# Altium schematic sheet 06-BatteryManagement.SchDoc: Battery Management
size A2; DocumentNumber: 6; SheetNumber: 6; SheetTotal: 15
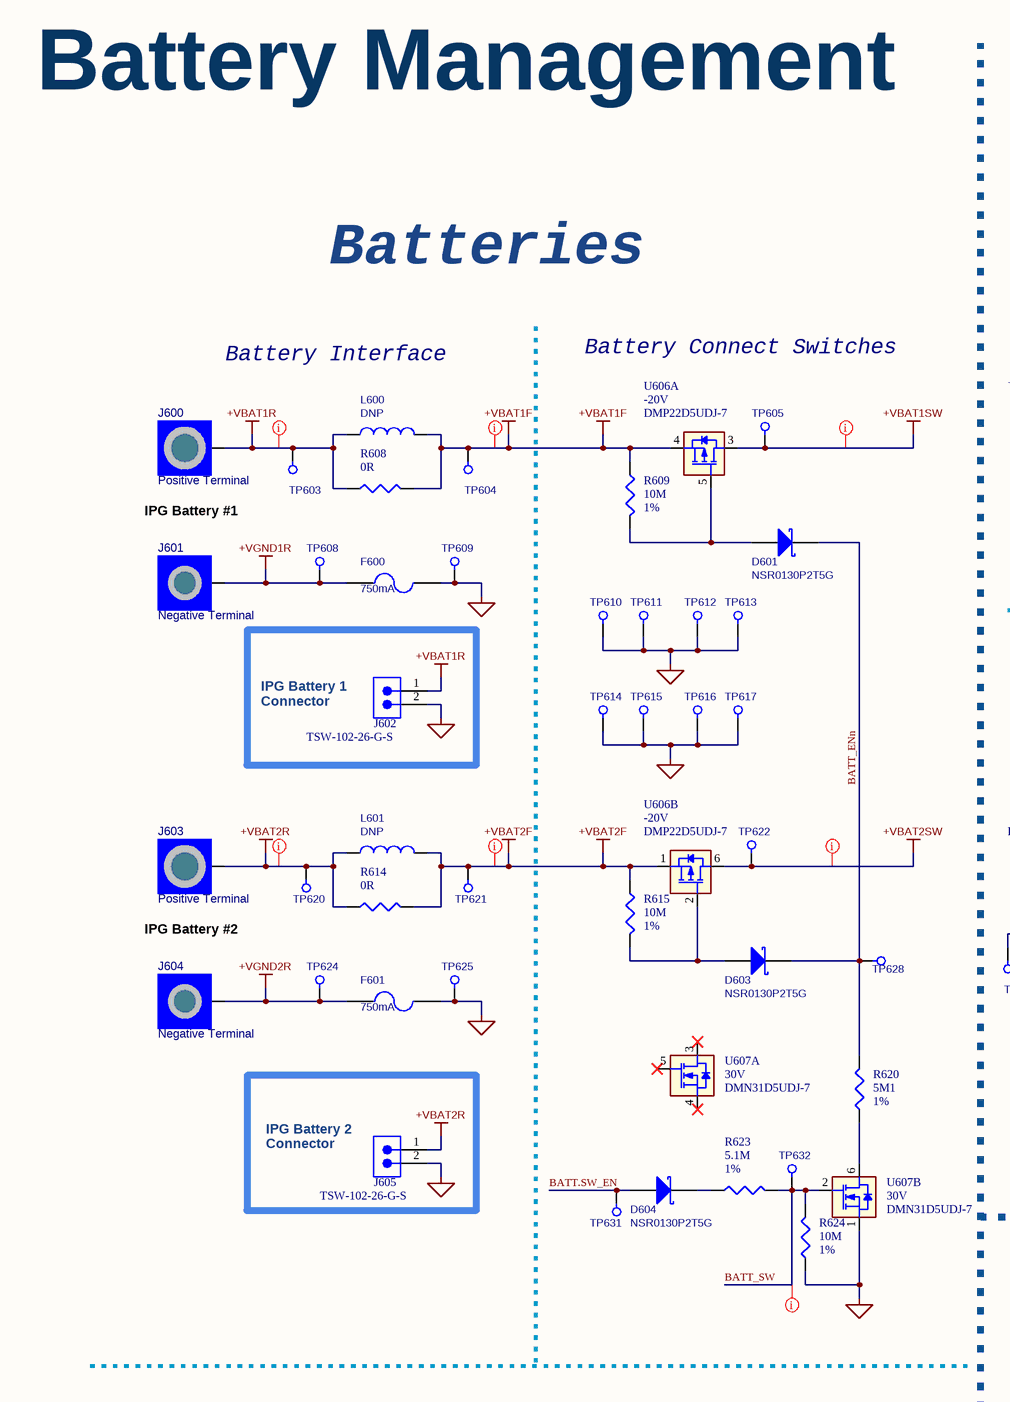
[diagram p0: 06-BatteryManagement.SchDoc, left]
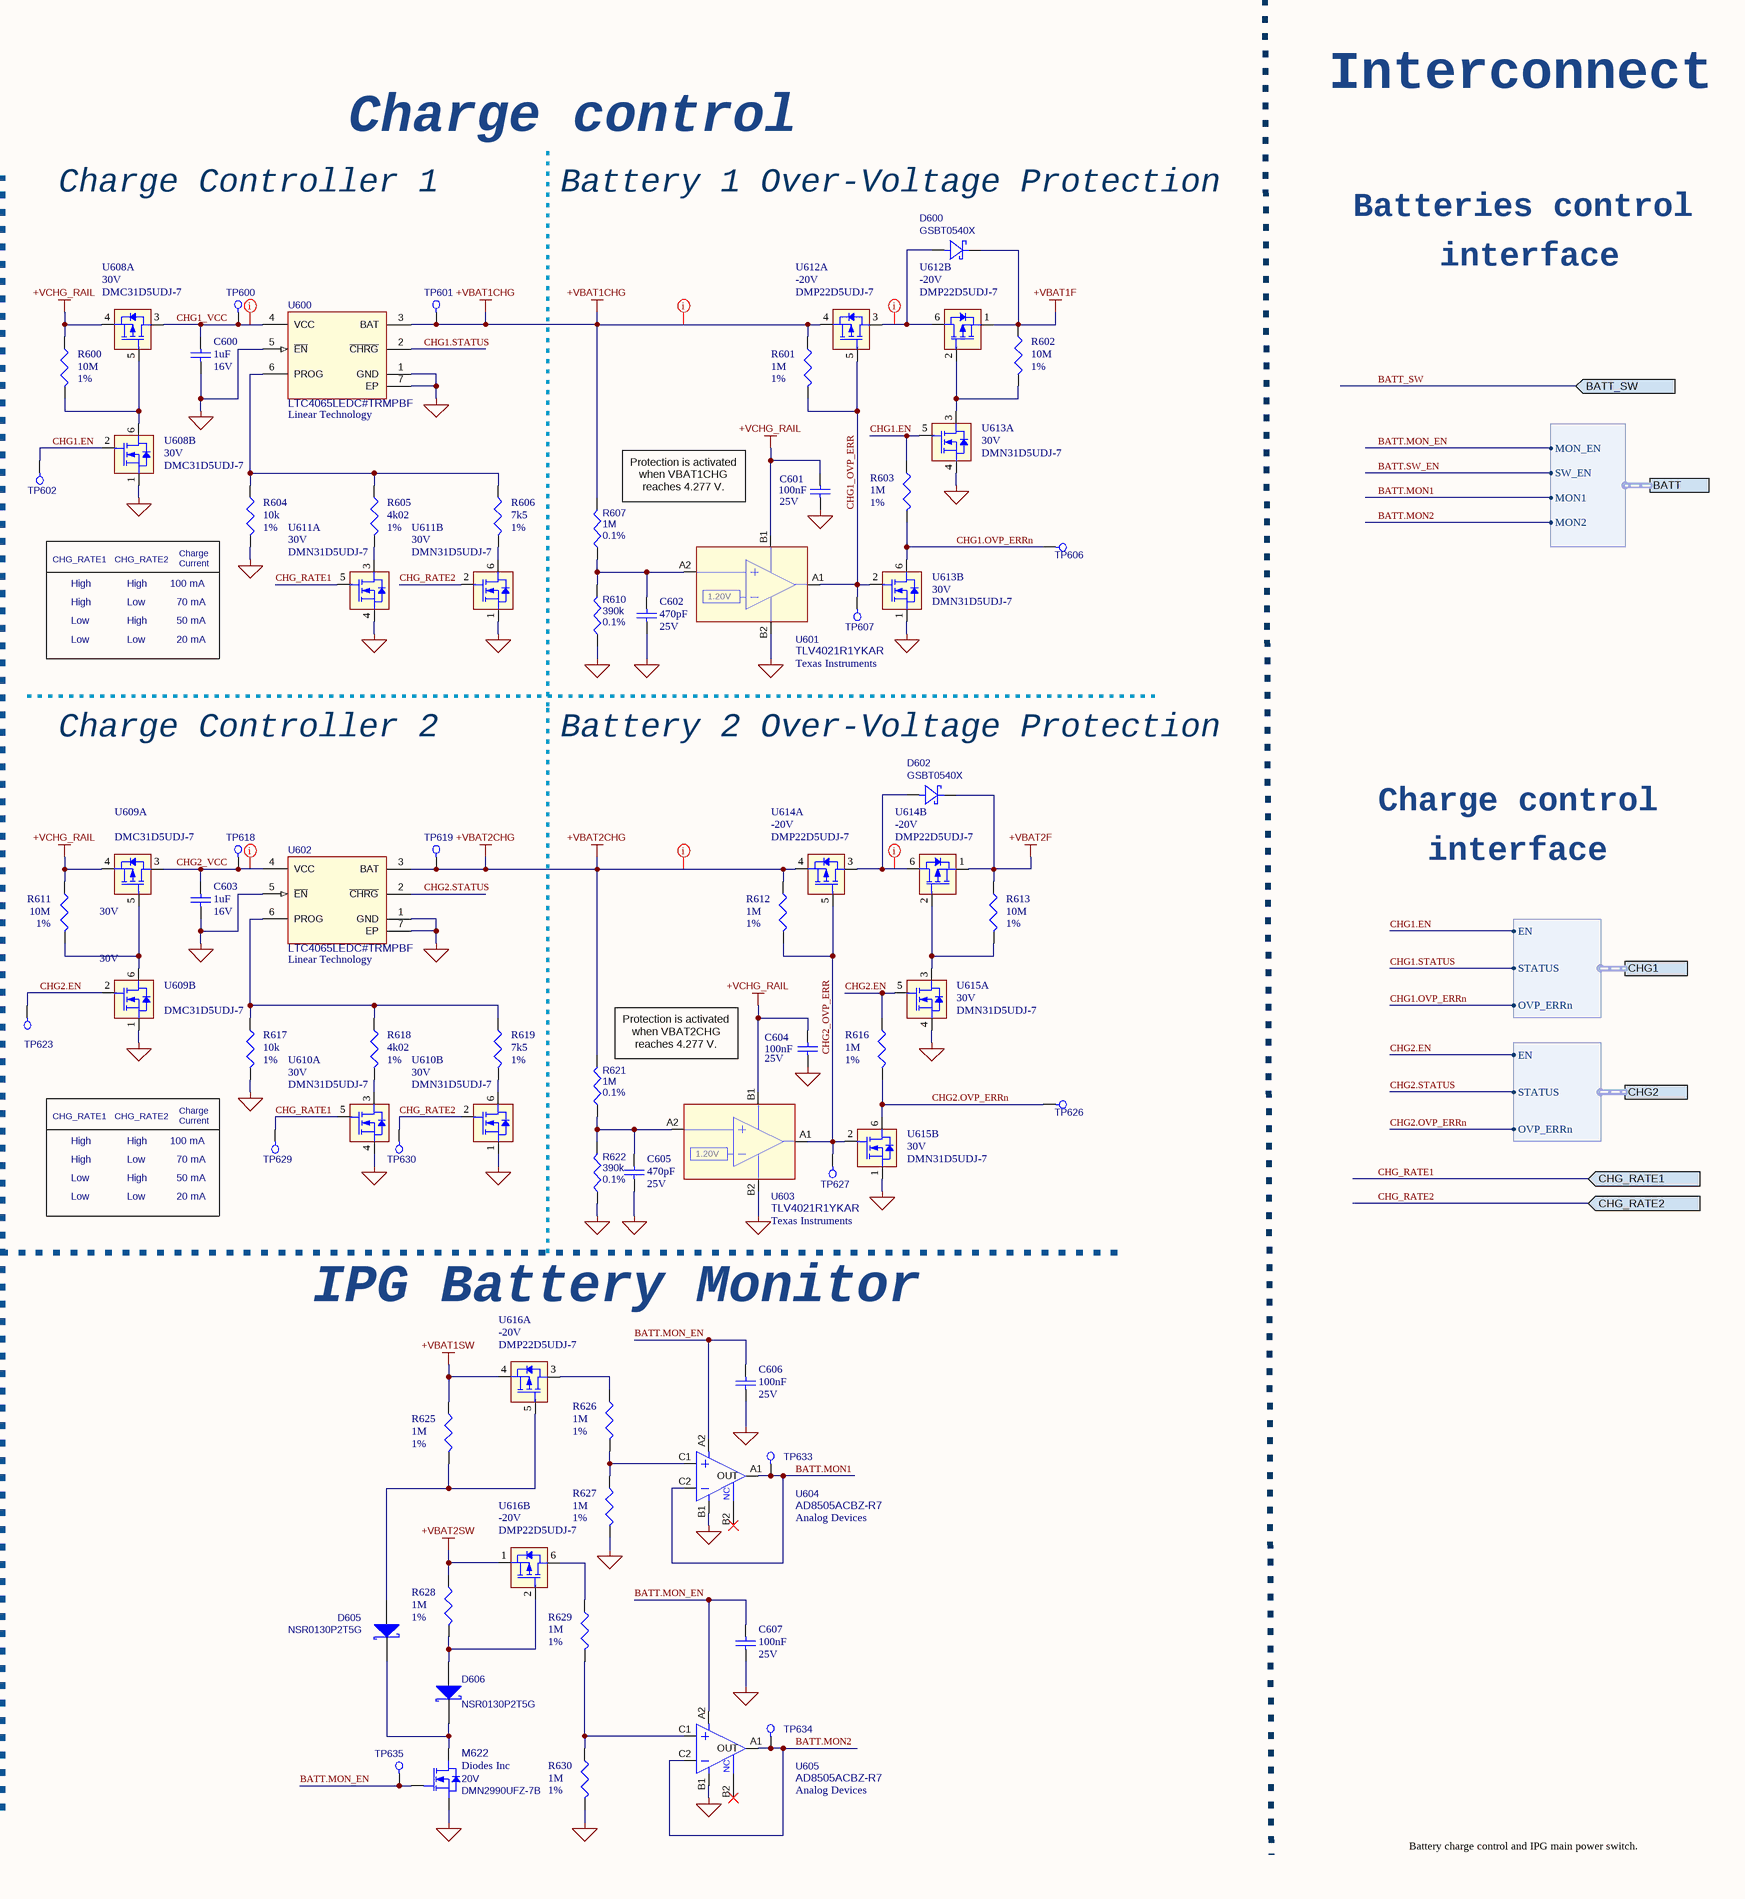
[diagram p1: 06-BatteryManagement.SchDoc, right]

## Parts
C600  value 1uF  Rated DC Voltage (URdc): 16V  [C0201_C]  (hidden comment: GRM033R61C105ME15D)
C601  value 100nF  Rated DC Voltage (URdc): 25V  [C0201_C]  (hidden comment: GRM033R61E104KE14J)
C602  value 470pF  Rated DC Voltage (URdc): 25V  [C0201_C]  (hidden comment: GCM033R71E471KA03D)
C603  value 1uF  Rated DC Voltage (URdc): 16V  [C0201_C]  (hidden comment: GRM033R61C105ME15D)
C604  value 100nF  Rated DC Voltage (URdc): 25V  [C0201_C]  (hidden comment: GRM033R61E104KE14J)
C605  value 470pF  Rated DC Voltage (URdc): 25V  [C0201_C]  (hidden comment: GCM033R71E471KA03D)
C606  value 100nF  Rated DC Voltage (URdc): 25V  [C0201_C]  (hidden comment: GRM033R61E104KE14J)
C607  value 100nF  Rated DC Voltage (URdc): 25V  [C0201_C]  (hidden comment: GRM033R61E104KE14J)
D600  GSBT0540X  [STM_SOD-523_R]
D601  NSR0130P2T5G  [ONSC_SOD-923_CASE514AB]
D602  GSBT0540X  [STM_SOD-523_R]
D603  NSR0130P2T5G  [ONSC_SOD-923_CASE514AB]
D604  NSR0130P2T5G  [ONSC_SOD-923_CASE514AB]
D605  NSR0130P2T5G  [ONSC_SOD-923_CASE514AB]
D606  NSR0130P2T5G  [ONSC_SOD-923_CASE514AB]
F600  value 750mA  [LITTELFUSE_440series_1206_REDUCED]  (hidden comment: 0440.750WR)
F601  value 750mA  [LITTELFUSE_440series_1206_REDUCED]  (hidden comment: 0440.750WR)
J600  value Positive Terminal  [Positive_Battery_PTH]  (hidden comment: Positive_Battery_PTH)  (no BOM)
J601  value Negative Terminal  [Negative_Battery_PTH]  (hidden comment: Negative_Battery_PTH)  (no BOM)
J602  TSW-102-26-G-S  [SMTC-TSW-102-26-XX-S]
J603  value Positive Terminal  [Positive_Battery_PTH]  (hidden comment: Positive_Battery_PTH)  (no BOM)
J604  value Negative Terminal  [Negative_Battery_PTH]  (hidden comment: Negative_Battery_PTH)  (no BOM)
J605  TSW-102-26-G-S  [SMTC-TSW-102-26-XX-S]
L600  DNP  [L0402_C]
L601  DNP  [L0402_C]
M622  DMN2990UFZ-7B  Manufacturer: Diodes Inc  Rating: 20V  [DIODESINC_X2-DFN0606-3]
R600  value 10M  Tolerance: 1%  [R0201_C]  (hidden comment: CRCW020110M0FNED)
R601  value 1M  Tolerance: 1%  [R0201_C]  (hidden comment: CRCW02011M00FNED)
R602  value 10M  Tolerance: 1%  [R0201_C]  (hidden comment: CRCW020110M0FNED)
R603  value 1M  Tolerance: 1%  [R0201_C]  (hidden comment: CRCW02011M00FNED)
R604  value 10k  Tolerance: 1%  [R0201_C]  (hidden comment: CRCW020110K0FNED)
R605  value 4k02  Tolerance: 1%  [R0201_C]  (hidden comment: CRCW02014K02FNED)
R606  value 7k5  Tolerance: 1%  [R0201_C]  (hidden comment: CRCW02017K50FNED)
R607  value 1M  Precision: 0.1%  [R0201_C]  (hidden comment: RE0201BRE071ML)
R608  value 0R  [R0201_C]  (hidden comment: CRCW02010000Z0ED)
R609  value 10M  Tolerance: 1%  [R0201_C]  (hidden comment: CRCW020110M0FNED)
R610  value 390k  Precision: 0.1%  [R0201_C]  (hidden comment: RGC1/20C3903BPA)
R611  value 10M  Tolerance: 1%  [R0201_C]  (hidden comment: CRCW020110M0FNED)
R612  value 1M  Tolerance: 1%  [R0201_C]  (hidden comment: CRCW02011M00FNED)
R613  value 10M  Tolerance: 1%  [R0201_C]  (hidden comment: CRCW020110M0FNED)
R614  value 0R  [R0201_C]  (hidden comment: CRCW02010000Z0ED)
R615  value 10M  Tolerance: 1%  [R0201_C]  (hidden comment: CRCW020110M0FNED)
R616  value 1M  Tolerance: 1%  [R0201_C]  (hidden comment: CRCW02011M00FNED)
R617  value 10k  Tolerance: 1%  [R0201_C]  (hidden comment: CRCW020110K0FNED)
R618  value 4k02  Tolerance: 1%  [R0201_C]  (hidden comment: CRCW02014K02FNED)
R619  value 7k5  Tolerance: 1%  [R0201_C]  (hidden comment: CRCW02017K50FNED)
R620  value 5M1  Tolerance: 1%  [R0201_C]  (hidden comment: CRCW02015M10FNED)
R621  value 1M  Precision: 0.1%  [R0201_C]  (hidden comment: RE0201BRE071ML)
R622  value 390k  Precision: 0.1%  [R0201_C]  (hidden comment: RGC1/20C3903BPA)
R623  value 5.1M  Tolerance: 1%  [R0201_C]  (hidden comment: CRCW02015M10FNED)
R624  value 10M  Tolerance: 1%  [R0201_C]  (hidden comment: CRCW020110M0FNED)
R625  value 1M  Tolerance: 1%  [R0201_C]  (hidden comment: CRCW02011M00FNED)
R626  value 1M  Tolerance: 1%  [R0201_C]  (hidden comment: CRCW02011M00FNED)
R627  value 1M  Tolerance: 1%  [R0201_C]  (hidden comment: CRCW02011M00FNED)
R628  value 1M  Tolerance: 1%  [R0201_C]  (hidden comment: CRCW02011M00FNED)
R629  value 1M  Tolerance: 1%  [R0201_C]  (hidden comment: CRCW02011M00FNED)
R630  value 1M  Tolerance: 1%  [R0201_C]  (hidden comment: CRCW02011M00FNED)
TP600  Test Point  [testpad_0.9mm]  (value not drawn)  (no BOM)
TP601  Test Point  [testpad_0.9mm]  (value not drawn)  (no BOM)
TP602  Test Point  [testpad_0.9mm]  (value not drawn)  (no BOM)
TP603  Test Point  [testpad_0.9mm]  (value not drawn)  (no BOM)
TP604  Test Point  [testpad_0.9mm]  (value not drawn)  (no BOM)
TP605  Test Point  [testpad_0.9mm]  (value not drawn)  (no BOM)
TP606  Test Point  [testpad_0.9mm]  (value not drawn)  (no BOM)
TP607  Test Point  [testpad_0.9mm]  (value not drawn)  (no BOM)
TP608  Test Point  [testpad_0.9mm]  (value not drawn)  (no BOM)
TP609  Test Point  [testpad_0.9mm]  (value not drawn)  (no BOM)
TP610  Test Point  [testpad_0.9mm]  (value not drawn)  (no BOM)
TP611  Test Point  [testpad_0.9mm]  (value not drawn)  (no BOM)
TP612  Test Point  [testpad_0.9mm]  (value not drawn)  (no BOM)
TP613  Test Point  [testpad_0.9mm]  (value not drawn)  (no BOM)
TP614  Test Point  [testpad_0.9mm]  (value not drawn)  (no BOM)
TP615  Test Point  [testpad_0.9mm]  (value not drawn)  (no BOM)
TP616  Test Point  [testpad_0.9mm]  (value not drawn)  (no BOM)
TP617  Test Point  [testpad_0.9mm]  (value not drawn)  (no BOM)
TP618  Test Point  [testpad_0.9mm]  (value not drawn)  (no BOM)
TP619  Test Point  [testpad_0.9mm]  (value not drawn)  (no BOM)
TP620  Test Point  [testpad_0.9mm]  (value not drawn)  (no BOM)
TP621  Test Point  [testpad_0.9mm]  (value not drawn)  (no BOM)
TP622  Test Point  [testpad_0.9mm]  (value not drawn)  (no BOM)
TP623  Test Point  [testpad_0.9mm]  (value not drawn)  (no BOM)
TP624  Test Point  [testpad_0.9mm]  (value not drawn)  (no BOM)
TP625  Test Point  [testpad_0.9mm]  (value not drawn)  (no BOM)
TP626  Test Point  [testpad_0.9mm]  (value not drawn)  (no BOM)
TP627  Test Point  [testpad_0.9mm]  (value not drawn)  (no BOM)
TP628  Test Point  [testpad_0.9mm]  (value not drawn)  (no BOM)
TP629  Test Point  [testpad_0.9mm]  (value not drawn)  (no BOM)
TP630  Test Point  [testpad_0.9mm]  (value not drawn)  (no BOM)
TP631  Test Point  [testpad_0.9mm]  (value not drawn)  (no BOM)
TP632  Test Point  [testpad_0.9mm]  (value not drawn)  (no BOM)
TP633  Test Point  [testpad_0.9mm]  (value not drawn)  (no BOM)
TP634  Test Point  [testpad_0.9mm]  (value not drawn)  (no BOM)
TP635  Test Point  [testpad_0.9mm]  (value not drawn)  (no BOM)
U600  value LTC4065LEDC#TRMPBF  Manufacturer: Linear Technology  [LT_DC6]  (hidden comment: LTC4065LEDC#TRPBF)
U601  Manufacturer: Texas Instruments  [TI_YKA0004]  (hidden comment: TLV4021R1YKAR)
U602  value LTC4065LEDC#TRMPBF  Manufacturer: Linear Technology  [LT_DC6]  (hidden comment: LTC4065LEDC#TRPBF)
U603  Manufacturer: Texas Instruments  [TI_YKA0004]  (hidden comment: TLV4021R1YKAR)
U604  Manufacturer: Analog Devices  [AD8505ACBZ-R7]  (hidden comment: AD8505ACBZ-R7)
U605  Manufacturer: Analog Devices  [AD8505ACBZ-R7]  (hidden comment: AD8505ACBZ-R7)
U606  DMP22D5UDJ-7  Vds(Max): -20V  [DIODESINC_SOT-963-6]  (parts A,B of 2)
U607  DMN31D5UDJ-7  Vds(Max): 30V  [DIODESINC_SOT-963-6]  (parts A,B of 2)
U608  DMC31D5UDJ-7  Vds(Max): 30V  [DIODESINC_SOT-963-6]  (parts A,B of 2)
U609  DMC31D5UDJ-7  Vds(Max): 30V  [DIODESINC_SOT-963-6]  (parts A,B of 2)
U610  DMN31D5UDJ-7  Vds(Max): 30V  [DIODESINC_SOT-963-6]  (parts A,B of 2)
U611  DMN31D5UDJ-7  Vds(Max): 30V  [DIODESINC_SOT-963-6]  (parts A,B of 2)
U612  DMP22D5UDJ-7  Vds(Max): -20V  [DIODESINC_SOT-963-6]  (parts A,B of 2)
U613  DMN31D5UDJ-7  Vds(Max): 30V  [DIODESINC_SOT-963-6]  (parts A,B of 2)
U614  DMP22D5UDJ-7  Vds(Max): -20V  [DIODESINC_SOT-963-6]  (parts A,B of 2)
U615  DMN31D5UDJ-7  Vds(Max): 30V  [DIODESINC_SOT-963-6]  (parts A,B of 2)
U616  DMP22D5UDJ-7  Vds(Max): -20V  [DIODESINC_SOT-963-6]  (parts A,B of 2)

## Ports
BATT (harness BATT), BATT_SW (in), CHG1 (harness CHG_CTRL), CHG2 (harness CHG_CTRL), CHG_RATE1 (in), CHG_RATE2 (in)

## Harnesses
CHG_CTRL: STATUS, OVP_ERRn, EN
BATT: MON_EN, SW_EN, MON1, MON2

## Nets
+VBAT1CHG: R601.1 R607.2 TP601.1 U600.3(BAT) U612.4
+VBAT1F: D600.1 L600.2 R602.1 R608.2 R609.1 TP604.1 U606.4 U612.1
+VBAT1R: J600.1 J602.1 L600.1 R608.1 TP603.1
+VBAT1SW: R625.1 TP605.1 U606.3 U616.4
+VBAT2CHG: R612.1 R621.2 TP619.1 U602.3(BAT) U614.4
+VBAT2F: D602.1 L601.2 R613.1 R614.2 R615.1 TP621.1 U606.1 U614.1
+VBAT2R: J603.1 J605.1 L601.1 R614.1 TP620.1
+VBAT2SW: R628.1 TP622.1 U606.6 U616.1
+VCHG_RAIL: C601.2 C604.2 R600.1 R611.1 U601.B1(V+) U603.B1(V+) U608.4 U609.4
+VGND1R: F600.1 J601.1 TP608.1
+VGND2R: F601.1 J604.1 TP624.1
GND: C600.2 C601.1 C602.1 C603.2 C604.1 C605.1 C606.1 C607.1 F600.2 F601.2 J602.2 J605.2 M622.2(S) R604.2 R610.1 R617.2 R622.1 R624.1 R627.2 R630.2 TP609.1 TP610.1 TP611.1 TP612.1 TP613.1 TP614.1 TP615.1 TP616.1 TP617.1 TP625.1 U600.1(GND) U600.5(~{EN}) U600.7(EP) U601.B2(V-) U602.1(GND) U602.5(~{EN}) U602.7(EP) U603.B2(V-) U604.B1(V-) U605.B1(V-) U607.1 U608.1 U609.1 U610.1 U610.4 U611.1 U611.4 U613.1 U613.4 U615.1 U615.4
BATT.MON1: TP633.1 U604.A1(OUT) U604.C2(IN-) ; port BATT.MON1
BATT.MON2: TP634.1 U605.A1(OUT) U605.C2(IN-) ; port BATT.MON2
BATT.MON_EN: C606.2 C607.2 M622.1(G) TP635.1 U604.A2(V+) U605.A2(V+) ; port BATT.MON_EN
BATT.SW_EN: D604.2(A) TP631.1 ; port BATT.SW_EN
BATT_ENn: D601.1(K) D603.1(K) R620.2 TP628.1
BATT_SW: R623.2 R624.2 TP632.1 U607.2 ; port BATT_SW
CHG1.EN: R603.1 TP602.1 U608.2 U613.5 ; port CHG1.EN
CHG1.OVP_ERRn: R603.2 TP606.1 U613.6 ; port CHG1.OVP_ERRn
CHG1.STATUS: U600.2(~{CHRG}) ; port CHG1.STATUS
CHG1_OVP_ERR: R601.2 TP607.1 U601.A1(OUT) U612.5 U613.2
CHG1_VCC: C600.1 TP600.1 U600.4(VCC) U608.3
CHG2.EN: R616.1 TP623.1 U609.2 U615.5 ; port CHG2.EN
CHG2.OVP_ERRn: R616.2 TP626.1 U615.6 ; port CHG2.OVP_ERRn
CHG2.STATUS: U602.2(~{CHRG}) ; port CHG2.STATUS
CHG2_OVP_ERR: R612.2 TP627.1 U603.A1(OUT) U614.5 U615.2
CHG2_VCC: C603.1 TP618.1 U602.4(VCC) U609.3
CHG_RATE1: TP629.1 U610.5 U611.5 ; port CHG_RATE1
CHG_RATE2: TP630.1 U610.2 U611.2 ; port CHG_RATE2
NetC602_2: C602.2 R607.1 R610.2 U601.A2(IN)
NetC605_2: C605.2 R621.1 R622.2 U603.A2(IN)
NetD600_2: D600.2 U612.3 U612.6
NetD601_2: D601.2(A) R609.2 U606.5
NetD602_2: D602.2 U614.3 U614.6
NetD603_2: D603.2(A) R615.2 U606.2
NetD604_1: D604.1(K) R623.1
NetD605_1: D605.1(K) D606.1(K) M622.3(D)
NetD605_2: D605.2(A) R625.2 U616.5
NetD606_2: D606.2(A) R628.2 U616.2
NetR600_2: R600.2 U608.5 U608.6
NetR602_2: R602.2 U612.2 U613.3
NetR604_1: R604.1 R605.1 R606.1 U600.6(PROG)
NetR605_2: R605.2 U611.3
NetR606_2: R606.2 U611.6
NetR611_2: R611.2 U609.5 U609.6
NetR613_2: R613.2 U614.2 U615.3
NetR617_1: R617.1 R618.1 R619.1 U602.6(PROG)
NetR618_2: R618.2 U610.3
NetR619_2: R619.2 U610.6
NetR620_1: R620.1 U607.6
NetR626_1: R626.1 U616.3
NetR626_2: R626.2 R627.1 U604.C1(IN+)
NetR629_1: R629.1 U616.6
NetR629_2: R629.2 R630.1 U605.C1(IN+)

Not connected (* = marked no-connect by the designer): U604 B2(NC)*; U605 B2(NC)*; U607 3* 4* 5*

## Layout directives
Voltage: 2.8-4.2V; net class POWER: +VBAT1CHG, +VBAT1F, +VBAT1R, +VBAT1SW, +VBAT2CHG, +VBAT2F, +VBAT2R, +VBAT2SW, NetD600_2, NetD602_2
rule Supply Nets [Voltage = 5.000]; net class POWER: CHG1_VCC, CHG2_VCC
net class ANALOG: BATT_SW

## Notes on the sheet
- Interconnect
- Charge control
- Battery Management
- Charge Controller 1
- Battery 1 Over-Voltage Protection
- Batteries control
- interface
- Batteries
- Battery Interface
- Battery Connect Switches
- (near R607) Protection is activated when VBAT1CHG reaches 4.277 V.
- CHG_RATE1
- CHG_RATE2
- IPG Battery #1
  Connections
- High
- Low
- (near R604) Charge
  Current
- 100 mA
- 70 mA
- 50 mA
- 20 mA
- Charge Controller 2
- Battery 2 Over-Voltage Protection
- (near J602) IPG Battery 1
  Connector
- IPG Battery #2
  Connections
- (near R621) Protection is activated when VBAT2CHG reaches 4.277 V.
- Charge
  Current
- (near J605) IPG Battery 2
  Connector
- IPG Battery Monitor
- Battery charge control and IPG main power switch.
- Project:
- Schematic:
- Design by:
- Date:
- Ver:
- .
- Comments:
- Reviewed by:
- (in symbol TLV4021R1YKAR) 1.20V

## Library data of the parts
C600 C603 = GRM033R61C105ME15D: Ceramic Capacitor, Multilayer, Ceramic, 16V, 20% +Tol, 20% -Tol, X5R, 15% TC, 1uF, Surface Mount, 0201; Manufacturer: Murata; Category: Ceramic Capacitors; Supplier: Digikey; Supplier Part Number: 490-18654-1-ND; Manufacturer Part Number: GRM033R61C105ME15D; RoHS: No; Stock: 132893; Pricing: 1=0,16, 10=0,105, 50=0,0628, 100=0,0493, 500=0,03644, 1000=0,03017, 2500=0,02808, 5000=0,02569 (USD); Supplier 1: Avnet; Supplier Part Number 1: GRM033R61C105ME15D
C601 C604 C606 C607 = GRM033R61E104KE14J: Ceramic Capacitor, Multilayer, Ceramic, 25V, 10% +Tol, 10% -Tol, X5R, 15% TC, 0.1uF, Surface Mount, 0201; Manufacturer: Murata; Multilayer: Yes; Category: Ceramic Capacitors; Supplier 1: Arrow Electronics; Supplier Part Number 1: GRM033R61E104KE14J; Manufacturer Part Number: GRM033R61E104KE14J; Supplier: Digikey; Supplier Part Number: 490-14571-1-ND; RoHS: Yes; Stock: 1540851; Pricing: 1=0,1, 10=0,033, 50=0,0192, 100=0,0148, 500=0,01118, 1000=0,00878, 2500=0,00798, 5000=0,00734 (USD); Mounting Technology: Surface Mount; Pins: 2; Dielectric Material: Ceramic; Package Shape: Rectangular; Case/Package: 0201; Terminal Finish: Nickel; Min Operating Temperature: -55°C; Max Operating Temperature: 85°C; JESD-609 Code: e3; Capacitor Type: Ceramic; Tolerance  (fill in as +-): 10%; Package Style: SMTMeter; Packaging: Tape and Reel; Tolerance (fill in as +-): 10%; Temperature Characteristics Code: X5R; Termination: Wraparound; Length: 0.6mm; Width: 0.3mm; Height: 0.3mm; Reach SVHC Compliant: Yes; RoHS Compliant: Yes; ComponentLink1URL: https://psearch.en.murata.com:443/capacitor/product/GRM033R61E104KE14%23.pdf?src-supplier=IHS+Markit; ComponentLink1Description: https://psearch.en.murata.com:443/capacitor/product/GRM033R61E104KE14%23.pdf?src-supplier=IHS+Markit; ComponentLink2URL: http://www.mouser.com/ds/2/281/c02e-2905.pdf?src-supplier=Mouser; ComponentLink2Description: http://www.mouser.com/ds/2/281/c02e-2905.pdf?src-supplier=Mouser; ComponentLink3URL: http://search.murata.co.jp/Ceramy/image/img/A01X/G101/ENG/GRM033R61E104KE14-01.pdf?src-supplier=Digikey; ComponentLink3Description: http://search.murata.co.jp/Ceramy/image/img/A01X/G101/ENG/GRM033R61E104KE14-01.pdf?src-supplier=Digikey; ComponentLink4URL: https://search.murata.co.jp/Ceramy/image/img/A01X/G101/ENG/GRM033R61E104KE14-01.pdf?src-supplier=Digikey; ComponentLink4Description: https://search.murata.co.jp/Ceramy/image/img/A01X/G101/ENG/GRM033R61E104KE14-01.pdf?src-supplier=Digikey
C602 C605 = GCM033R71E471KA03D: Ceramic Capacitor, Multilayer, Ceramic, 25V, 10% +Tol, 10% -Tol, X7R, 15% TC, 0.00047uF, Surface Mount, 0201; Manufacturer: Murata; Multilayer: Yes; Reference Standard: AEC-Q200; Category: Ceramic Capacitors; Supplier: Digikey; Supplier Part Number: 490-17744-1-ND; Manufacturer Part Number: GCM033R71E471KA03D; RoHS: Yes; Stock: 21174; Pricing: 1=0,1, 10=0,028, 50=0,016, 100=0,0125, 500=0,00938, 1000=0,00736, 2500=0,0067, 5000=0,00616 (USD); Mounting Technology: Surface Mount; Pins: 2; Dielectric Material: Ceramic; Package Shape: Rectangular; Case/Package: 0201; Terminal Finish: Nickel; Min Operating Temperature: -55°C; Max Operating Temperature: 125°C; JESD-609 Code: e3; Capacitor Type: Ceramic; Tolerance  (fill in as +-): 10%; Package Style: SMTMeter; Packaging: Tape and Reel; Tolerance (fill in as +-): 10%; Temperature Characteristics Code: X7R; Termination: Wraparound; Length: 0.6mm; Width: 0.3mm; Height: 0.33mm; Reach SVHC Compliant: Yes; RoHS Compliant: Yes; ComponentLink1URL: https://psearch.en.murata.com:443/capacitor/product/GCM033R71E471KA03%23.pdf?src-supplier=IHS+Markit; ComponentLink1Description: https://psearch.en.murata.com:443/capacitor/product/GCM033R71E471KA03%23.pdf?src-supplier=IHS+Markit; ComponentLink2URL: https://datasheet.ciiva.com/11604/product-11604532.pdf?src-supplier=Avnet; ComponentLink2Description: https://datasheet.ciiva.com/11604/product-11604532.pdf?src-supplier=Avnet; ComponentLink3URL: https://datasheet.ciiva.com/163/s0717e-163390.pdf?src-supplier=Digikey; ComponentLink3Description: https://datasheet.ciiva.com/163/s0717e-163390.pdf?src-supplier=Digikey; Supplier 1: Arrow Electronics; Supplier Part Number 1: GCM033R71E471KA03D
D600 D602 = GSBT0540X: DIODE SCHOTTKY 40V 500MA SOD523; Manufacturer: Good-Ark Semiconductor; Medical Grade MFR: TBD; Rating: 40V, 500mA; Medical Grade MFR PN: TBD; PCB Footprint: TBD; Category: Diode; Package Description: SOD-523; Supplier 1: Digikey; Supplier Part Number 1: 4786-GSBT0540XCT-ND; Manufacturer Part Number: GSBT0540X
D601 D603-D606 = NSR0130P2T5G: Schottky, 30V, 100mA, 385mV, 200mW, SOD-923; Manufacturer: ON Semiconductor; Medical Grade MFR: TBD; Review: 020823; Length (mm): 1.00 ±0.05; Medical Grade MFR PN: TBD; PCB Footprint: TBD; Rating: 30V; Thickness (mm): 0.40 ±0.03; Value: NSR0130P2T5G; Width (mm): 0.60 ±0.05; Category: Diode; Supplier 1: Future Electronics; Supplier Part Number 1: 7098145; Status: Approved; Manufacturer Part Number: NSR0130P2T5G
F600 F601 = 0440.750WR: Fuse, 750mA, 63V, 1206; Manufacturer: Littelfuse; Medical Grade MFR PN: 0440.750WRA; PCB Footprint: fuse1206_reduced; Review: 020823; Length (mm): 3.20 ±0.18; Medical Grade MFR: Littelfuse; Rating: 750mA; Thickness (mm): 0.84 ±0.01; Width (mm): 1.63 ±0.10; Category: Fuse; Supplier 1: Digi-Key; Supplier Part Number 1: F1603CT-ND; Status: Approved; Manufacturer Part Number: 0440.750WR
J600 J603 = Positive_Battery_PTH: Positive terminal battery PTH connector for the QL0200I-A battery; Manufacturer: Quallion; PCB Footprint: TBD; Manufacturer Part Number: QL0200I-A; Medical Grade MFR: N/A; Medical Grade MFR PN: N/A; Rating: N/A; Category: Connector; Length (mm): TBD; Thickness (mm): TBD; Width (mm): TBD; Status: *; Review: *; Type: Battery Connector
J601 J604 = Negative_Battery_PTH: Negative terminal battery PTH connector for the QL0200I-A battery; Manufacturer: Quallion; PCB Footprint: TBD; Manufacturer Part Number: QL0200I-A; Medical Grade MFR: N/A; Medical Grade MFR PN: N/A; Rating: N/A; Category: Connector; Length (mm): TBD; Thickness (mm): TBD; Width (mm): TBD; Status: *; Review: *; Type: Battery Connector
J602 J605 = TSW-102-26-G-S: Conn Unshrouded Header HDR 2 POS 2.54mm Solder ST Thru-Hole; Manufacturer: Samtec; Number of Contacts: 2; Gender: Male; Max Current Rating: 7.6A; Max Voltage Rating (AC): 550V; RoHS: True; ComponentLink1Description: Manufacturer URL; DatasheetVersion: F-214; Orientation: Vertical; Pitch: 2.54 mm; ComponentLink1URL: http://www.samtec.com; ComponentLink3Description: Package Specification; ComponentLink2Description: Datasheet; PackageVersion: DM, 8/1988; PackageDescription: .025[0.64] SQ. Post Terminal Strip Assembly; PackageReference: TSW-102-26-XX-S; Mounting Technology: Through-hole; Temperature Range: -55 to 125 degC; ComponentLink3URL: http://www.samtec.com/documents/webfiles/cpdf/TSW-XXX-XX-XXX-X-XX-XXX-MKT.pdf; ComponentLink2URL: http://www.samtec.com/documents/webfiles/pdf/TSW_TH.PDF; PartNumber: TSW-102-26-G-S; Supplier: Newark; Supplier Part Number: 12P1301; Manufacturer Part Number: TSW-102-26-G-S; Category: Connectors; Stock: 3117; Pricing: 1=0.51000, 10=0.47500, 100=0.33200, 500=0.28400, 1000=0.23700, 2500=0.21000, 5000=0.20400 (USD); Contact Material: Bronze; Contact Finish - Mating: GOLD; Insulation Color: Black; Insulation Material: PBT; Connector Type: Header; Termination: Solder; Flammability Rating: UL94 V-0; Reach SVHC Compliant: Yes; RoHS Compliant: Yes; ComponentLink4URL: https://datasheet.ciiva.com/10281/htsw-th-10281416.pdf?src-supplier=Avnet; ComponentLink4Description: https://datasheet.ciiva.com/10281/htsw-th-10281416.pdf?src-supplier=Avnet; ComponentLink5URL: https://datasheet.ciiva.com/6887/tsw-xxx-xx-xxx-x-xx-xxx-mkt-6887237.pdf?src-supplier=Digi-Key; ComponentLink5Description: https://datasheet.ciiva.com/6887/tsw-xxx-xx-xxx-x-xx-xxx-mkt-6887237.pdf?src-supplier=Digi-Key; Supplier 1: Digikey; Supplier Part Number 1: SAM1077-02-ND; Contact Plating: Gold; Color: Black; Housing Material: Polyester; Contact Shape: Square; Housing Color: Black; Min Operating Temperature: -55°C; Max Operating Temperature: 125°C; Number of Rows: 1; Packaging: Bulk; Number of Positions: 2; Series: TSW; Contact Type: Male Pin; Fastening Type: Pull; Package Quantity: 1; Length: 5.08mm; Width: 2.54mm; Contact Mating Length: 0.23inch; Depth: 2.54mm; Radiation Hardening: No; Lead Free: Lead Free
L600 L601 = IND_DNP_0402: DNP: Inductor, DNP, 0402; PCB Footprint: ind0402_reduced; Review: 020823; Value: DNP; Length (mm): 1.11; Manufacturer: N/A; Manufacturer PN: N/A; Medical Grade MFR: N/A; Medical Grade MFR PN: N/A; Rating: N/A; Thickness (mm): 0.65; Width (mm): 0.66; Category: Inductor; Package Description: 0402; Status: Approved
M622 = DMN2990UFZ-7B: MOSFET, N-Chan, 20V, 170mA, DFN0606; Medical Grade MFR: TBD; Review: 020823; Category: Transistor; Length (mm): 0.62 ±0.05; Medical Grade MFR PN: TBD; PCB Footprint: TBD; Thickness (mm): 0.38 ±0.02; Value: DMN2990UFZ-7B; Width (mm): 0.62 ±0.05; Supplier 1: Digi-Key; Supplier Part Number 1: DMN2990UFZ-7BDICT-ND; Status: Approved; Manufacturer Part Number: DMN2990UFZ-7B
R600 R602 R609 R611 R613 R615 R624 = CRCW020110M0FNED: Fixed Resistor, Metal Glaze/thick Film, 0.05W, 10000000ohm, 30V, 1% +/-Tol, 200ppm/Cel, Surface Mount, 0201; Manufacturer: Vishay Draloric; Medical Grade MFR: Mini-Systems; Medical Grade MFR PN: MWA96SM-1005F-NS62TR; Power: 50mW; Rated Temperature: 70°C; Temperature Coefficient: 200ppm/°C; Category: Chip SMD Resistors; Supplier: Mouser; Supplier Part Number: 71-CRCW020110M0FNED; Manufacturer Part Number: CRCW020110M0FNED; RoHS: Yes; Stock: 159754; Pricing: 1=0,1, 10=0,024, 50=0,024, 100=0,014, 1000=0,011, 10000=0,006 (USD); Mounting Technology: Surface Mount; Pins: 2; Package Shape: Rectangular; Case/Package: 0201; Terminal Finish: Nickel; Min Operating Temperature: -55°C; Max Operating Temperature: 155°C; JESD-609 Code: e3; Resistor Type: FIXED RESISTOR; Packaging: Tape and Reel; Technology: METAL GLAZE/THICK FILM; Termination: Wraparound; Working Voltage: 30V; Reach SVHC Compliant: Yes; RoHS Compliant: Yes; ComponentLink1URL: https://datasheet.ciiva.com:443/pdfs/VipMasterIC/IC/VISH/VISH-S-A0002932828/VISH-S-A0002932828-1.pdf?src-supplier=IHS+Markit; ComponentLink1Description: https://datasheet.ciiva.com:443/pdfs/VipMasterIC/IC/VISH/VISH-S-A0002932828/VISH-S-A0002932828-1.pdf?src-supplier=IHS+Markit; ComponentLink2URL: https://datasheet.ciiva.com/7673/1719906-7673177.pdf?src-supplier=Element14; ComponentLink2Description: https://datasheet.ciiva.com/7673/1719906-7673177.pdf?src-supplier=Element14; ComponentLink3URL: https://datasheet.ciiva.com/7673/1719906-7673178.pdf?src-supplier=Element14; ComponentLink3Description: https://datasheet.ciiva.com/7673/1719906-7673178.pdf?src-supplier=Element14; ComponentLink4URL: https://datasheet.ciiva.com/22692/1719906-22692711.pdf?src-supplier=Element14; ComponentLink4Description: https://datasheet.ciiva.com/22692/1719906-22692711.pdf?src-supplier=Element14; ComponentLink5URL: https://datasheet.ciiva.com/22665/1700795-22665701.pdf?src-supplier=Element14; ComponentLink5Description: https://datasheet.ciiva.com/22665/1700795-22665701.pdf?src-supplier=Element14; Supplier 1: Digikey; Supplier Part Number 1: 541-CRCW020110M0FNEDCT-ND
R601 R603 R612 R616 R625-R630 = CRCW02011M00FNED: Fixed Resistor, Metal Glaze/thick Film, 0.05W, 1000000ohm, 30V, 1% +/-Tol, 200ppm/Cel, Surface Mount, 0201; Manufacturer: Vishay; Medical Grade MFR: Mini-Systems; Medical Grade MFR PN: MWA96SM-1004F-NS62TR; Power: 50mW; Rated Temperature: 70°C; Temperature Coefficient: 200ppm/°C; Package Height: 0.23mm; Package Length: 0.6mm; Package Width: 0.3mm; Reference Standard: AEC-Q200; Category: Chip SMD Resistors; Supplier: Digikey; Supplier Part Number: 541-1.00MABCT-ND; Manufacturer Part Number: CRCW02011M00FNED; RoHS: Yes; Stock: 392914; Pricing: 1=0,1, 10=0,037, 50=0,0242, 100=0,0204, 500=0,01426, 1000=0,01241, 5000=0,00924 (USD); Mounting Technology: Surface Mount; Pins: 2; Package Shape: Rectangular; Case/Package: 0201; Terminal Finish: Nickel; Min Operating Temperature: -55°C; Max Operating Temperature: 155°C; JESD-609 Code: e3; Resistor Type: FIXED RESISTOR; Construction: Chip; Package Style: SMTMeter; Packaging: Tape and Reel; Technology: METAL GLAZE/THICK FILM; Termination: Wraparound; Working Voltage: 30V; Reach SVHC Compliant: Yes; RoHS Compliant: Yes; ComponentLink1URL: https://datasheet.ciiva.com:443/pdfs/VipMasterIC/IC/VISH/VISH-S-A0002932828/VISH-S-A0002932828-1.pdf?src-supplier=IHS+Markit; ComponentLink1Description: https://datasheet.ciiva.com:443/pdfs/VipMasterIC/IC/VISH/VISH-S-A0002932828/VISH-S-A0002932828-1.pdf?src-supplier=IHS+Markit; ComponentLink2URL: https://datasheet.ciiva.com/7841/1719906-7841438.pdf?src-supplier=Element14; ComponentLink2Description: https://datasheet.ciiva.com/7841/1719906-7841438.pdf?src-supplier=Element14; ComponentLink3URL: https://datasheet.ciiva.com/7841/1719906-7841439.pdf?src-supplier=Element14; ComponentLink3Description: https://datasheet.ciiva.com/7841/1719906-7841439.pdf?src-supplier=Element14; ComponentLink4URL: https://datasheet.ciiva.com/7859/dcrcwe3-7859689.pdf?src-supplier=Element14; ComponentLink4Description: https://datasheet.ciiva.com/7859/dcrcwe3-7859689.pdf?src-supplier=Element14; ComponentLink5URL: https://datasheet.ciiva.com/16757/70202042-16757675.pdf?src-supplier=Allied+Electronics; ComponentLink5Description: https://datasheet.ciiva.com/16757/70202042-16757675.pdf?src-supplier=Allied+Electronics; ComponentLink6URL: https://datasheet.ciiva.com/22692/1719906-22692761.pdf?src-supplier=Element14; ComponentLink6Description: https://datasheet.ciiva.com/22692/1719906-22692761.pdf?src-supplier=Element14; ComponentLink7URL: https://datasheet.ciiva.com/9109/crcw0201e3-9109910.pdf?src-supplier=Avnet; ComponentLink7Description: https://datasheet.ciiva.com/9109/crcw0201e3-9109910.pdf?src-supplier=Avnet; ComponentLink8URL: https://datasheet.ciiva.com/22675/1847332-22675065.pdf?src-supplier=Element14; ComponentLink8Description: https://datasheet.ciiva.com/22675/1847332-22675065.pdf?src-supplier=Element14; ComponentLink9URL: https://datasheet.ciiva.com/2474/crcw0201e3-2474824.pdf?src-supplier=Digikey; ComponentLink9Description: https://datasheet.ciiva.com/2474/crcw0201e3-2474824.pdf?src-supplier=Digikey; ComponentLink10URL: https://datasheet.ciiva.com/2474/crcw0201e3-2474825.pdf?src-supplier=Digikey; ComponentLink10Description: https://datasheet.ciiva.com/2474/crcw0201e3-2474825.pdf?src-supplier=Digikey; ComponentLink11URL: https://datasheet.ciiva.com/2474/crcw0201e3-2474826.pdf?src-supplier=Digikey; ComponentLink11Description: https://datasheet.ciiva.com/2474/crcw0201e3-2474826.pdf?src-supplier=Digikey; Supplier 1: Digikey; Supplier Part Number 1: 541-1.00MABCT-ND
R604 R617 = CRCW020110K0FNED: Fixed Resistor, Metal Glaze/thick Film, 0.05W, 10000ohm, 30V, 1% +/-Tol, 200ppm/Cel, Surface Mount, 0201; Manufacturer: Vishay; Medical Grade MFR: Mini-Systems; Medical Grade MFR PN: MWA96SM-1002F-NS62TR; Power: 50mW; Rated Temperature: 70°C; Temperature Coefficient: 200ppm/°C; Package Height: 0.23mm; Package Length: 0.6mm; Package Width: 0.3mm; Reference Standard: AEC-Q200; Category: Chip SMD Resistors; Supplier: Digikey; Supplier Part Number: 541-10.0KABCT-ND; Manufacturer Part Number: CRCW020110K0FNED; RoHS: Yes; Stock: 1011530; Pricing: 1=0,1, 10=0,037, 50=0,0242, 100=0,0204, 500=0,01426, 1000=0,01241, 5000=0,00924 (USD); Mounting Technology: Surface Mount; Pins: 2; Package Shape: Rectangular; Case/Package: 0201; Terminal Finish: Nickel; Min Operating Temperature: -55°C; Max Operating Temperature: 155°C; JESD-609 Code: e3; Resistor Type: FIXED RESISTOR; Construction: Chip; Package Style: SMTMeter; Packaging: Tape and Reel; Technology: METAL GLAZE/THICK FILM; Termination: Wraparound; Working Voltage: 30V; Reach SVHC Compliant: Yes; RoHS Compliant: Yes; ComponentLink1URL: https://datasheet.ciiva.com:443/pdfs/VipMasterIC/IC/VISH/VISH-S-A0002932828/VISH-S-A0002932828-1.pdf?src-supplier=IHS+Markit; ComponentLink1Description: https://datasheet.ciiva.com:443/pdfs/VipMasterIC/IC/VISH/VISH-S-A0002932828/VISH-S-A0002932828-1.pdf?src-supplier=IHS+Markit; ComponentLink2URL: https://datasheet.ciiva.com/2474/crcw0201e3-2474819.pdf?src-supplier=Digikey; ComponentLink2Description: https://datasheet.ciiva.com/2474/crcw0201e3-2474819.pdf?src-supplier=Digikey; ComponentLink3URL: https://datasheet.ciiva.com/2474/crcw0201e3-2474820.pdf?src-supplier=Digikey; ComponentLink3Description: https://datasheet.ciiva.com/2474/crcw0201e3-2474820.pdf?src-supplier=Digikey; ComponentLink4URL: https://datasheet.ciiva.com/2474/crcw0201e3-2474818.pdf?src-supplier=Digikey; ComponentLink4Description: https://datasheet.ciiva.com/2474/crcw0201e3-2474818.pdf?src-supplier=Digikey; ComponentLink5URL: https://datasheet.ciiva.com/16436/dcrcwe3-16436222.pdf?src-supplier=Future+Electronics; ComponentLink5Description: https://datasheet.ciiva.com/16436/dcrcwe3-16436222.pdf?src-supplier=Future+Electronics; ComponentLink6URL: https://datasheet.ciiva.com/7983/1719906-7983320.pdf?src-supplier=Element14; ComponentLink6Description: https://datasheet.ciiva.com/7983/1719906-7983320.pdf?src-supplier=Element14; ComponentLink7URL: https://datasheet.ciiva.com/7983/1719906-7983319.pdf?src-supplier=Element14; ComponentLink7Description: https://datasheet.ciiva.com/7983/1719906-7983319.pdf?src-supplier=Element14; ComponentLink8URL: https://datasheet.ciiva.com/22692/1719906-22692709.pdf?src-supplier=Element14; ComponentLink8Description: https://datasheet.ciiva.com/22692/1719906-22692709.pdf?src-supplier=Element14; Supplier 1: Mouser; Supplier Part Number 1: 71-CRCW0201-10K
R605 R618 = CRCW02014K02FNED: Fixed Resistor, Metal Glaze/thick Film, 0.05W, 4020ohm, 30V, 1% +/-Tol, 200ppm/Cel, Surface Mount, 0201; Manufacturer: Vishay; Medical Grade MFR: Mini-Systems; Medical Grade MFR PN: MWA96SM-4021F-NS62TR; Power: 50mW; Rated Temperature: 70°C; Temperature Coefficient: 200ppm/°C; Package Height: 0.23mm; Package Length: 0.6mm; Package Width: 0.3mm; Reference Standard: AEC-Q200; Category: Chip SMD Resistors; Supplier: Digikey; Supplier Part Number: 541-CRCW02014K02FNEDCT-ND; Manufacturer Part Number: CRCW02014K02FNED; RoHS: Yes; Stock: 14472; Pricing: 1=0,1, 10=0,037, 50=0,0242, 100=0,0204, 500=0,01426, 1000=0,01241, 5000=0,00924 (USD); Mounting Technology: Surface Mount; Pins: 2; Package Shape: Rectangular; Case/Package: 0201; Terminal Finish: Nickel; Min Operating Temperature: -55°C; Max Operating Temperature: 155°C; JESD-609 Code: e3; Resistor Type: FIXED RESISTOR; Construction: Chip; Package Style: SMTMeter; Packaging: Tape and Reel; Technology: METAL GLAZE/THICK FILM; Termination: Wraparound; Working Voltage: 30V; Reach SVHC Compliant: Yes; RoHS Compliant: Yes; ComponentLink1URL: https://datasheet.ciiva.com:443/pdfs/VipMasterIC/IC/VISH/VISH-S-A0002932828/VISH-S-A0002932828-1.pdf?src-supplier=IHS+Markit; ComponentLink1Description: https://datasheet.ciiva.com:443/pdfs/VipMasterIC/IC/VISH/VISH-S-A0002932828/VISH-S-A0002932828-1.pdf?src-supplier=IHS+Markit; ComponentLink2URL: https://datasheet.ciiva.com/7690/1719906-7690620.pdf?src-supplier=Element14; ComponentLink2Description: https://datasheet.ciiva.com/7690/1719906-7690620.pdf?src-supplier=Element14; ComponentLink3URL: https://datasheet.ciiva.com/7690/1719906-7690621.pdf?src-supplier=Element14; ComponentLink3Description: https://datasheet.ciiva.com/7690/1719906-7690621.pdf?src-supplier=Element14; ComponentLink4URL: https://datasheet.ciiva.com/9074/crcw0201e3-9074873.pdf?src-supplier=Avnet; ComponentLink4Description: https://datasheet.ciiva.com/9074/crcw0201e3-9074873.pdf?src-supplier=Avnet; ComponentLink5URL: https://datasheet.ciiva.com/22675/1700795-22675166.pdf?src-supplier=Element14; ComponentLink5Description: https://datasheet.ciiva.com/22675/1700795-22675166.pdf?src-supplier=Element14; Supplier 1: Digikey; Supplier Part Number 1: 541-CRCW02014K02FNEDCT-ND
R606 R619 = CRCW02017K50FNED: Fixed Resistor, Metal Glaze/thick Film, 0.05W, 7500ohm, 30V, 1% +/-Tol, 200ppm/Cel, Surface Mount, 0201; Manufacturer: Vishay; Medical Grade MFR: Mini-Systems; Medical Grade MFR PN: MWA96SM-7501F-NS62TR; Power: 50mW; Rated Temperature: 70°C; Temperature Coefficient: 200ppm/°C; Package Height: 0.23mm; Package Length: 0.6mm; Package Width: 0.3mm; Reference Standard: AEC-Q200; Category: Chip SMD Resistors; Supplier: Digikey; Supplier Part Number: 541-7.50KABCT-ND; Manufacturer Part Number: CRCW02017K50FNED; RoHS: Yes; Stock: 42220; Pricing: 1=0,1, 10=0,037, 50=0,0242, 100=0,0204, 500=0,01426, 1000=0,01241, 5000=0,00924 (USD); Mounting Technology: Surface Mount; Pins: 2; Package Shape: Rectangular; Case/Package: 0201; Terminal Finish: Nickel; Min Operating Temperature: -55°C; Max Operating Temperature: 155°C; JESD-609 Code: e3; Resistor Type: FIXED RESISTOR; Construction: Chip; Package Style: SMTMeter; Packaging: Tape and Reel; Technology: METAL GLAZE/THICK FILM; Termination: Wraparound; Working Voltage: 30V; Reach SVHC Compliant: Yes; RoHS Compliant: Yes; ComponentLink1URL: https://datasheet.ciiva.com:443/pdfs/VipMasterIC/IC/VISH/VISH-S-A0002932828/VISH-S-A0002932828-1.pdf?src-supplier=IHS+Markit; ComponentLink1Description: https://datasheet.ciiva.com:443/pdfs/VipMasterIC/IC/VISH/VISH-S-A0002932828/VISH-S-A0002932828-1.pdf?src-supplier=IHS+Markit; ComponentLink2URL: https://datasheet.ciiva.com/2474/crcw0201e3-2474815.pdf?src-supplier=Digikey; ComponentLink2Description: https://datasheet.ciiva.com/2474/crcw0201e3-2474815.pdf?src-supplier=Digikey; ComponentLink3URL: https://datasheet.ciiva.com/2474/crcw0201e3-2474816.pdf?src-supplier=Digikey; ComponentLink3Description: https://datasheet.ciiva.com/2474/crcw0201e3-2474816.pdf?src-supplier=Digikey; ComponentLink4URL: https://datasheet.ciiva.com/2474/crcw0201e3-2474817.pdf?src-supplier=Digikey; ComponentLink4Description: https://datasheet.ciiva.com/2474/crcw0201e3-2474817.pdf?src-supplier=Digikey; ComponentLink5URL: https://datasheet.ciiva.com/9058/crcw0201e3-9058555.pdf?src-supplier=Avnet; ComponentLink5Description: https://datasheet.ciiva.com/9058/crcw0201e3-9058555.pdf?src-supplier=Avnet; ComponentLink6URL: https://datasheet.ciiva.com/7679/1719906-7679036.pdf?src-supplier=Element14; ComponentLink6Description: https://datasheet.ciiva.com/7679/1719906-7679036.pdf?src-supplier=Element14; ComponentLink7URL: https://datasheet.ciiva.com/7679/1719906-7679037.pdf?src-supplier=Element14; ComponentLink7Description: https://datasheet.ciiva.com/7679/1719906-7679037.pdf?src-supplier=Element14; ComponentLink8URL: https://datasheet.ciiva.com/22704/1719906-22704599.pdf?src-supplier=Element14; ComponentLink8Description: https://datasheet.ciiva.com/22704/1719906-22704599.pdf?src-supplier=Element14; Supplier 1: Digikey; Supplier Part Number 1: 541-7.50KABCT-ND
R607 R621 = RE0201BRE071ML: Resistor, 1M, 0.1%, 0201; Manufacturer: Yageo; Medical Grade MFR: TBD; PCB Footprint: res0201_reduced; Rating: 25V; Length (mm): 0.6; Manufacturer Part Number: RE0201BRE071ML; Medical Grade MFR PN: TBD; Thickness (mm): 0.23; Width (mm): 0.3; Category: Resistor; Supplier 1: Digikey; Supplier Part Number 1: 13-RE0201BRE071MLCT-ND; Status: *; Review: *; Supplier 2: Digikey; Supplier Part Number 2: 13-RE0201BRE071MLDKR-ND; Supplier 3: Digikey; Supplier Part Number 3: 13-RE0201BRE071MLTR-ND; Supplier 4: Mouser; Supplier Part Number 4: 603-RE0201BRE071ML
R608 R614 = CRCW02010000Z0ED: Fixed Resistor, Metal Glaze/thick Film, 0.05W, 0ohm, Surface Mount, 0201; Manufacturer: Vishay; Medical Grade MFR: Mini-Systems; Medical Grade MFR PN: MWA96SM-0000F-NS62TR; Power: 50mW; Rated Temperature: 70°C; Package Height: 0.23mm; Package Length: 0.6mm; Package Width: 0.3mm; Reference Standard: AEC-Q200; Category: Chip SMD Resistors; Supplier: Digikey; Supplier Part Number: 541-0.0AGCT-ND; Manufacturer Part Number: CRCW02010000Z0ED; RoHS: Yes; Stock: 701366; Pricing: 1=0,1, 10=0,034, 25=0,026, 50=0,0198, 100=0,0138, 250=0,01112, 500=0,0089, 1000=0,00655, 5000=0,0047 (USD); Mounting Technology: Surface Mount; Pins: 2; Package Shape: Rectangular; Case/Package: 0201; Terminal Finish: Nickel; Min Operating Temperature: -55°C; Max Operating Temperature: 155°C; JESD-609 Code: e3; Resistor Type: FIXED RESISTOR; Construction: Chip; Package Style: SMTMeter; Packaging: Tape and Reel; Technology: METAL GLAZE/THICK FILM; Termination: Wraparound; Reach SVHC Compliant: Yes; RoHS Compliant: Yes; ComponentLink1URL: https://datasheet.ciiva.com:443/pdfs/VipMasterIC/IC/VISH/VISH-S-A0002932828/VISH-S-A0002932828-1.pdf?src-supplier=IHS+Markit; ComponentLink1Description: https://datasheet.ciiva.com:443/pdfs/VipMasterIC/IC/VISH/VISH-S-A0002932828/VISH-S-A0002932828-1.pdf?src-supplier=IHS+Markit; ComponentLink2URL: https://datasheet.ciiva.com/2471/crcw0201e3-2471712.pdf?src-supplier=Digikey; ComponentLink2Description: https://datasheet.ciiva.com/2471/crcw0201e3-2471712.pdf?src-supplier=Digikey; ComponentLink3URL: https://datasheet.ciiva.com/7841/1719906-7841431.pdf?src-supplier=Element14; ComponentLink3Description: https://datasheet.ciiva.com/7841/1719906-7841431.pdf?src-supplier=Element14; ComponentLink4URL: https://datasheet.ciiva.com/7841/1719906-7841430.pdf?src-supplier=Element14; ComponentLink4Description: https://datasheet.ciiva.com/7841/1719906-7841430.pdf?src-supplier=Element14; ComponentLink5URL: https://datasheet.ciiva.com/22665/1847332-22665688.pdf?src-supplier=Element14; ComponentLink5Description: https://datasheet.ciiva.com/22665/1847332-22665688.pdf?src-supplier=Element14; ComponentLink6URL: https://datasheet.ciiva.com/2471/crcw0201e3-2471713.pdf?src-supplier=Digikey; ComponentLink6Description: https://datasheet.ciiva.com/2471/crcw0201e3-2471713.pdf?src-supplier=Digikey; ComponentLink7URL: https://datasheet.ciiva.com/2471/crcw0201e3-2471711.pdf?src-supplier=Digikey; ComponentLink7Description: https://datasheet.ciiva.com/2471/crcw0201e3-2471711.pdf?src-supplier=Digikey; ComponentLink8URL: https://datasheet.ciiva.com/16757/70202042-16757849.pdf?src-supplier=Allied+Electronics; ComponentLink8Description: https://datasheet.ciiva.com/16757/70202042-16757849.pdf?src-supplier=Allied+Electronics; ComponentLink9URL: https://datasheet.ciiva.com/16436/crcw0201e3-16436237.pdf?src-supplier=Future+Electronics; ComponentLink9Description: https://datasheet.ciiva.com/16436/crcw0201e3-16436237.pdf?src-supplier=Future+Electronics; Supplier 1: Digikey; Supplier Part Number 1: 541-0.0AGDKR-ND
R610 R622 = RGC1/20C3903BPA: Resistor, 390k, 0.1%, 0201; Manufacturer: Kamaya; Medical Grade MFR: TBD; PCB Footprint: res0201_reduced; Rating: 25V; Length (mm): 0.6; Manufacturer Part Number: RGC1/20C3903BPA; Medical Grade MFR PN: TBD; Thickness (mm): 0.23; Width (mm): 0.3; Category: Resistor; Supplier 1: Digikey; Supplier Part Number 1: 2315-RGC1/20C3903BPATR-ND; Status: *; Review: *; Supplier 2: Mouser; Supplier Part Number 2: 791-RGC1/20C3903BPA
R620 = CRCW02015M10FNED: Fixed Resistor, Metal Glaze/thick Film, 0.05W, 5100000ohm, 30V, 1% +/-Tol, 200ppm/Cel, Surface Mount, 0201; Manufacturer: Vishay Draloric; Manufacturer Series: CRCW0201E3; Medical Grade MFR: TBD; Power: 50mW; Rated Temperature: 70°C; Temperature Coefficient: 200ppm/°C; Supplier: Digikey; Supplier Part Number: 541-CRCW02015M10FNEDCT-ND; Manufacturer Part Number: CRCW02015M10FNED; RoHS: Yes; Category: Chip SMD Resistors; Stock: 56300; Pricing: 1=0,1, 10=0,037, 50=0,0242, 100=0,0204, 500=0,01426, 1000=0,01241, 5000=0,00924 (USD); Mounting Technology: Surface Mount; Pins: 2; Package Shape: Rectangular; Case/Package: 0201; Terminal Finish: Nickel; Min Operating Temperature: -55°C; Max Operating Temperature: 155°C; JESD-609 Code: e3; Resistor Type: FIXED RESISTOR; Packaging: Tape and Reel; Technology: METAL GLAZE/THICK FILM; Termination: Wraparound; Working Voltage: 30V; Reach SVHC Compliant: Yes; RoHS Compliant: Yes; ComponentLink1URL: https://datasheet.ciiva.com:443/pdfs/VipMasterIC/IC/VISH/VISH-S-A0002932828/VISH-S-A0002932828-1.pdf?src-supplier=IHS+Markit; ComponentLink1Description: https://datasheet.ciiva.com:443/pdfs/VipMasterIC/IC/VISH/VISH-S-A0002932828/VISH-S-A0002932828-1.pdf?src-supplier=IHS+Markit; ComponentLink2URL: https://datasheet.ciiva.com/7843/1719906-7843192.pdf?src-supplier=Element14; ComponentLink2Description: https://datasheet.ciiva.com/7843/1719906-7843192.pdf?src-supplier=Element14; ComponentLink3URL: https://datasheet.ciiva.com/7843/1719906-7843193.pdf?src-supplier=Element14; ComponentLink3Description: https://datasheet.ciiva.com/7843/1719906-7843193.pdf?src-supplier=Element14; ComponentLink4URL: https://datasheet.ciiva.com/6073/1719906-6073775.pdf?src-supplier=Farnell; ComponentLink4Description: https://datasheet.ciiva.com/6073/1719906-6073775.pdf?src-supplier=Farnell; Medical Grade MFR PN: TBD; Supplier 1: Digikey; Supplier Part Number 1: 541-CRCW02015M10FNEDCT-ND
R623 = CRCW02015M10FNED: Fixed Resistor, Metal Glaze/thick Film, 0.05W, 5100000ohm, 30V, 1% +/-Tol, 200ppm/Cel, Surface Mount, 0201; Manufacturer: Vishay Draloric; Medical Grade MFR: TBD; Manufacturer Series: CRCW0201E3; Power: 50mW; Rated Temperature: 70°C; Temperature Coefficient: 200ppm/°C; Category: Chip SMD Resistors; Supplier: Digikey; Supplier Part Number: 541-CRCW02015M10FNEDCT-ND; Manufacturer Part Number: CRCW02015M10FNED; RoHS: Yes; Stock: 56300; Pricing: 1=0,1, 10=0,037, 50=0,0242, 100=0,0204, 500=0,01426, 1000=0,01241, 5000=0,00924 (USD); Mounting Technology: Surface Mount; Pins: 2; Package Shape: Rectangular; Case/Package: 0201; Terminal Finish: Nickel; Min Operating Temperature: -55°C; Max Operating Temperature: 155°C; JESD-609 Code: e3; Resistor Type: FIXED RESISTOR; Packaging: Tape and Reel; Technology: METAL GLAZE/THICK FILM; Termination: Wraparound; Working Voltage: 30V; Reach SVHC Compliant: Yes; RoHS Compliant: Yes; ComponentLink1URL: https://datasheet.ciiva.com:443/pdfs/VipMasterIC/IC/VISH/VISH-S-A0002932828/VISH-S-A0002932828-1.pdf?src-supplier=IHS+Markit; ComponentLink1Description: https://datasheet.ciiva.com:443/pdfs/VipMasterIC/IC/VISH/VISH-S-A0002932828/VISH-S-A0002932828-1.pdf?src-supplier=IHS+Markit; ComponentLink2URL: https://datasheet.ciiva.com/7843/1719906-7843192.pdf?src-supplier=Element14; ComponentLink2Description: https://datasheet.ciiva.com/7843/1719906-7843192.pdf?src-supplier=Element14; ComponentLink3URL: https://datasheet.ciiva.com/7843/1719906-7843193.pdf?src-supplier=Element14; ComponentLink3Description: https://datasheet.ciiva.com/7843/1719906-7843193.pdf?src-supplier=Element14; ComponentLink4URL: https://datasheet.ciiva.com/6073/1719906-6073775.pdf?src-supplier=Farnell; ComponentLink4Description: https://datasheet.ciiva.com/6073/1719906-6073775.pdf?src-supplier=Farnell; Medical Grade MFR PN: TBD; Supplier 1: Digikey; Supplier Part Number 1: 541-CRCW02015M10FNEDCT-ND
TP600-TP635 = Test Point: Test pad, 0.90mm circular pad; PCB Footprint: testpad_0p90mm; Length (mm): 0.90; Manufacturer: N/A; Manufacturer PN: N/A; Medical Grade MFR: N/A; Medical Grade MFR PN: N/A; Rating: N/A; Thickness (mm): N/A; Value: Test point; Width (mm): 0.90; Category: Test point; Status: *; Review: *
U600 U602 = LTC4065LEDC#TRPBF: Charge Controller, 4.2V, 250mA, DFN-6; Medical Grade MFR: TBD; Category: IC; Length (mm): 2.00 ±0.10; Medical Grade MFR PN: TBD; PCB Footprint: TBD; Rating: 250mA; Thickness (mm): 0.75 ±0.05; Width (mm): 2.00 ±0.10; Alt Manufacturer: -; Alt Manufacturer PN: -; Supplier 1: Digi-Key; Supplier Part Number 1: 505-LTC4065LEDC#TRPBFCT-ND; Supplier Link: https://www.analog.com/en/products/ltc4065l.html; Datasheet: https://datasheet.ciiva.com/pdfs/VipMasterIC/IC/ANDI/ANDI-S-A0006647666/ANDI-S-A0006647666-1.pdf?src-supplier=IHS+Markit; Status: *; Review: *; Manufacturer Part Number: LTC4065LEDC#TRPBF
U601 U603 = TLV4021R1YKAR: Comparator, 1.2V Reference, Open-drain, BGA-4; Medical Grade MFR: TBD; Category: IC; Length (mm): 0.73 ±0.03; Medical Grade MFR PN: TBD; Package Description: TBD; PCB Footprint: TBD; Rating: TBD; Thickness (mm): 0.40; Supplier 1: Digi-Key; Supplier Part Number 1: 296-TLV4021R1YKARCT-ND; Status: *; Review: *; Manufacturer Part Number: TLV4021R1YKAR; Value: TLV4021R1YKAR
U604 U605 = AD8505ACBZ-R7: Op Amp, Rail-to-Rail, 95kHz, WLCSP-6; Medical Grade MFR: TBD; Rating: 5.5V; Category: IC; Length (mm): 1.39 ±0.04; Medical Grade MFR PN: TBD; PCB Footprint: TBD; Thickness (mm): 0.56 ±0.05; Width (mm): 0.90 ±0.04; Package Description: TBD; Supplier 1: Digi-Key; Supplier Part Number 1: AD8505ACBZ-R7CT-ND; Status: *; Review: *; Manufacturer Part Number: AD8505ACBZ-R7; Value: AD8505ACBZ-R7
U606 U612 U614 U616 = DMP22D5UDJ-7: MOSFET 2P-CH 20V 0.36A SOT963; Manufacturer: Diodes inc.; Number of Channels: 2; Power Dissipation: 380mW; Id(Max): -360mA; Vgs(Max): ±8V; Vth(Max): -1.0V; Ron(Max): 5Ohm; Cin: 17pF; Manufacturer Part Number: DMP22D5UDJ-7; Category: Transistors; Type: MOSFET array; RoHs: RoHS 2; Package: SOT-963; Supplier 1: Digikey; Supplier Part Number 1: 31-DMP22D5UDJ-7DKR-ND
U607 U610 U611 U613 U615 = DMN31D5UDJ-7: MOSFET 2N-CH 30V 0.22A SOT963; Manufacturer: Diodes inc.; Number of Channels: 2; Power Dissipation: 350mW; Id(Max): 220mA; Vgs(Max): ±12V; Vth(Max): 1.0V; Ron(Max): 4.5Ohm; Cin: 22.6pF; Manufacturer Part Number: DMN31D5UDJ-7; Category: Transistors; Type: MOSFET array; RoHs: RoHS 2; Package: SOT-963; Supplier 1: Digikey; Supplier Part Number 1: 31-DMN31D5UDJ-7CT-ND
U608 U609 = DMC31D5UDJ-7: MOSFET N/P-CH 30V 0.22A SOT963; Manufacturer: Diodes inc.; Number of Channels: 2; Power Dissipation: 350mW; Id(Max): -200mA; Vgs(Max): ±12V; Vth(Max): -1.0V; Ron(Max): 4.5Ohm; Cin: 22.6pF; Manufacturer Part Number: DMC31D5UDJ-7; Category: Transistors; Type: MOSFET array; RoHs: RoHS 2; Package: SOT-963; Supplier 1: Digikey; Supplier Part Number 1: DMC31D5UDJ-7DICT-ND